# EAGLE design untitled (EAGLE 9.6.2)
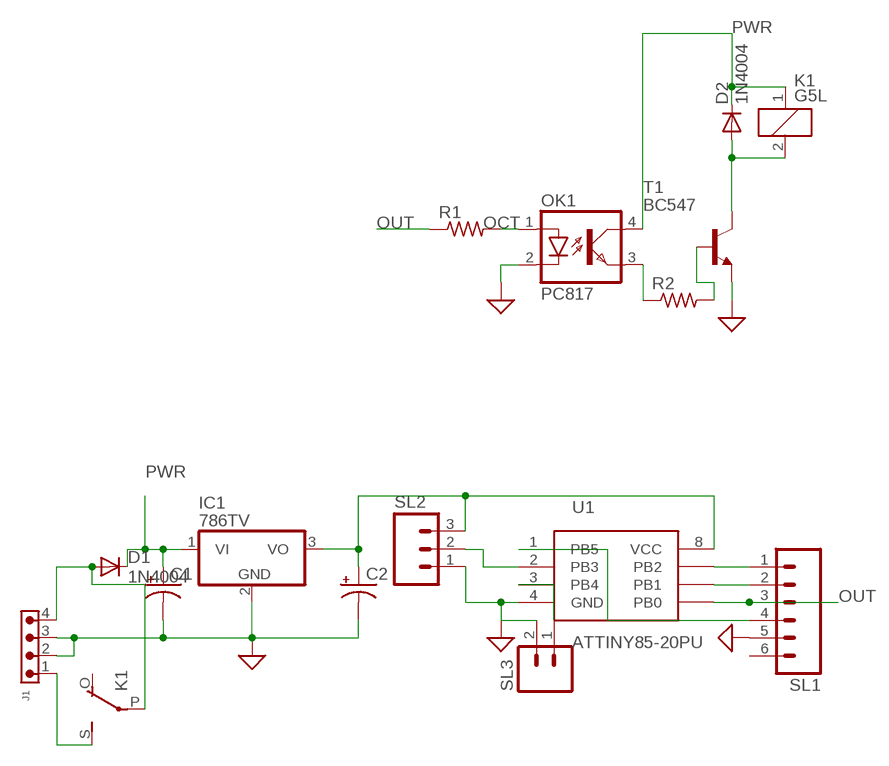
[diagram p0: schematic, sheet 1]

## Parts
C1  CAPACITOR-PE5-10.5  [E5-10,5]
C2  CAPACITOR-PE2.5-5  [E2,5-5]
D1  1N4004  [DO41-10]
D2  1N4004  [DO41-10]
IC1  786TV  [TO220V]
J1  691305530004  [691305530004]
K1  G5L  [G5LE]
OK1  PC817  [DIL04]
R1  R-US_0411/15  [0411/15]
R2  R-US_0207/10  [0207/10]
SL1  M06  [06P]
SL2  M03  [03P]
SL3  M02  [02P]
T1  BC547  [TO92]
U1  ATTINY85-20PU  [PDIP-8]

## Nets
GND: C1.- C2.- IC1.2(GND) J1.2 J1.3 OK1.2(C) SL1.5 SL2.1 SL3.2 T1.1(E) U1.4(GND) ; supply symbol labelled SUP
N$1: D1.A J1.4 K1.P(2:P)
N$2: SL1.1 U1.7(PB2)
N$3: C2.+ IC1.3(VO) SL2.3 U1.8(VCC)
N$4: OK1.3(EMIT) R2.1
N$5: D2.A K1.2 T1.3(C)
N$6: J1.1 K1.S(2:S)
N$7: R2.2 T1.2(B)
N$8: SL1.2 U1.6(PB1)
N$10: SL1.4 U1.1(PB5)
N$11: SL2.2 U1.2(PB3)
N$12: SL3.1 U1.3(PB4)
OCT: OK1.1(A) R1.2
OUT: R1.1 SL1.3 U1.5(PB0)
PWR: C1.+ D1.C D2.C IC1.1(VI) K1.1 OK1.4(COL)
Unconnected: K1.O(2:O) SL1.6

## Library data of the parts
C1 C2 = BeagleBone_Blue_R3:CAPACITOR-P: POLARIZED CAPACITOR, American symbol
D1 D2 = adafruit:1N4004: DIODE General purpose 1N400x type rectifier (With bigger pads) http://www.ladyada.net/library/pcb/eaglelibrary.html
IC1 = linear:78*: Positive VOLTAGE REGULATOR Source: http://cache.national.com/ds/LM/LM78L05.pdf http://www.fairchildsemi.com/ds/LM/LM7805.pdf
J1 = Wurth_Connectors_WR-TBL Pluggable Connector:691305530004: WR-TBL Serie 3055 - 5,08 mm - PCB Header Vertical Entry with Plastic Latches KIND PROPERTIES Pitch 5.08 mm MATERIAL PROPERTIES Insulator Material PA66 Insulator Flammability Rating UL94 V-0 Insulator Color Green Terminal Material Copper Alloy Terminal Plating Tin-plated surface GENERAL INFORMATION Operating Temperature -40 up to +105 °C ELECTRICAL PROPERTIES IR UL 16 A Working Voltage [UL] 300 V (AC) Withstanding Voltage [UL] 2500 V (AC) Contact Resistance [UL] 20 mΩ CERTIFICATION UL Approval E315414 <https://www.we-online.com/catalog/media/o135349v209%20Family_WR-TBL3_6913055300xx.jpg> Details see: https://www.we-online.com/catalog/en/TBL_5_08_3055_6913055300XX/ Updated by Ella Wu 2019-12-30 2019(C) Wurth Elektronik; DATASHEET-URL: https://www.we-online.com/catalog/datasheet/691305530004.pdf; IR-UL: 16A; MOUNT: THT; PART-NUMBER: 691305530004; PINS: 4; PITCH: 5.08mm; TYPE: Vertical; WORKING-VOLTAGE-UL: 300V (AC)
K1 = relay:G5L: RELAY 1 x switch, 10 A/120 V AC, 8 A/30 V ADC, Omron; OC_FARNELL: unknown; OC_NEWARK: unknown
OK1 = optocoupler:PC817: SHARP OPTO COUPLER; MPN: PC817X4J000F; OC_FARNELL: 9707727; OC_NEWARK: 97K7059
R1 = BeagleBone_Black_Wireless:R-US_: RESISTOR, American symbol
R2 = adafruit:R-US_: RESISTOR, American symbol
SL1 = con-amp-quick:M06: AMP QUICK CONNECTOR; OC_FARNELL: unknown; OC_NEWARK: unknown
SL2 = con-amp-quick:M03: AMP QUICK CONNECTOR; OC_FARNELL: unknown; OC_NEWARK: unknown
SL3 = con-amp-quick:M02: AMP QUICK CONNECTOR; OC_FARNELL: unknown; OC_NEWARK: unknown
T1 = transistor:BC547: NPN TRANSISTOR
U1 = Microcontroller:ATTINY85-20PU: IC MCU 8BIT 8KB FLASH 8DIP Manufacturer's datasheet <http://ww1.microchip.com/downloads/en/DeviceDoc/Atmel-2586-AVR-8-bit-Microcontroller-ATtiny25-ATtiny45-ATtiny85_Datasheet-Summary.pdf>; CREATED_BY: PCBLayout.com; DIGI_KEY_PART_NUMBER: ATTINY85-20PU-ND; MANUFACTURER: Microchip Technology; MPN: ATTINY85-20PU; PACKAGE: 8-PDIP

## Board
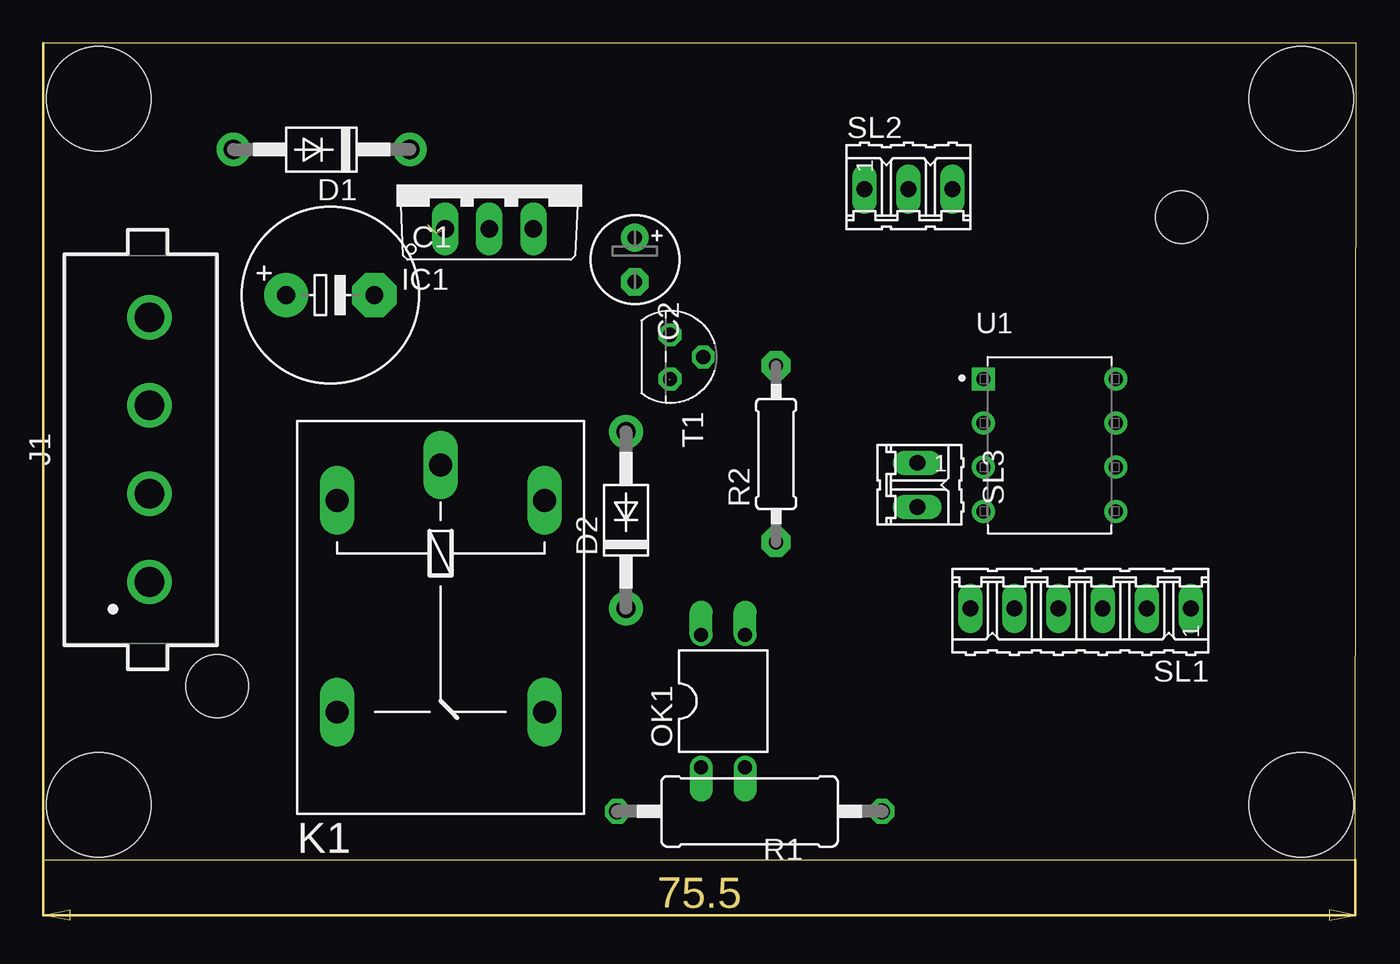
[diagram p1: board, top side]
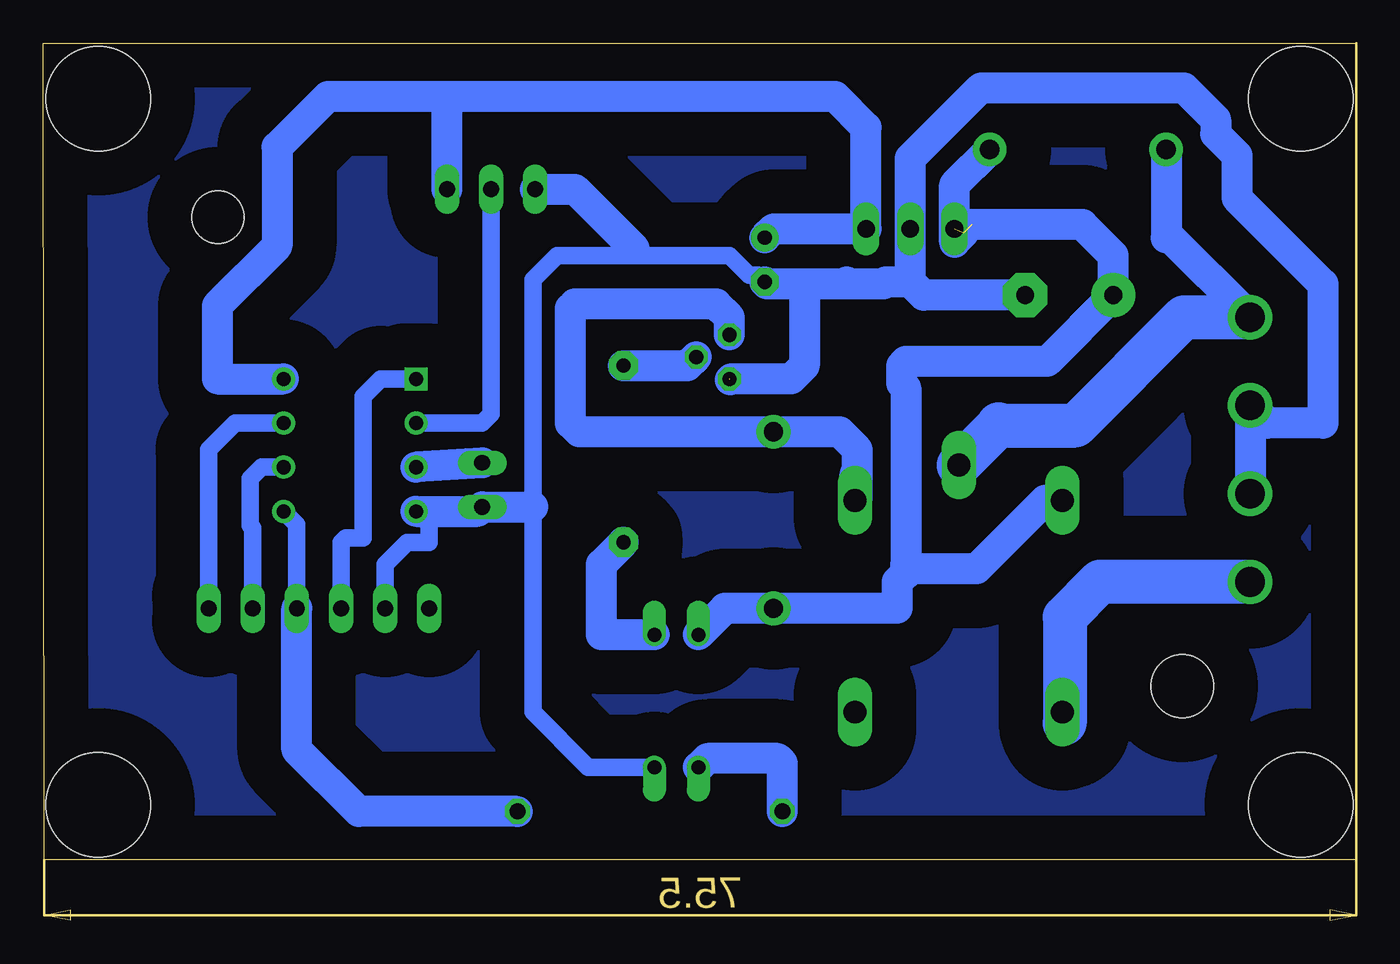
[diagram p2: board, bottom side, seen from below]

Size 75.55 x 47 mm. Coordinates in mm from the lower left corner, seen from the top.
Outline: 0,0 75.5,0 75.55,47 0,47 0,0
Copper layers (1*16): Top 0.035mm / dielectric 1.5mm / Bottom 0.035mm
Design rules "default *": minimum track width 6mil, minimum drill 0.35mm, track to track 30mil, track to pad 30mil, pad to pad 30mil, via to via 30mil, smd to smd 6mil, copper to edge 40mil, drill to drill 6mil, minimum pad ring 10mil, minimum via ring 8mil, stop-mask expansion 4mil, vias tented up to drill 0mil, thermal gap 10mil
Holes 6 mm at 3.17,43.81 3.17,3.17 72.39,3.17 72.39,43.81
Holes 3.6 mm at 10,10
Holes 3 mm at 65.5,37

### Footprints (pad centres in the part's own frame; a part is rotated, then mirrored left to right if it is on the bottom)
E5-10,5 = drill 1.016 pad 2.54: + -2.54,0 | drill 1.016 pad 2.54 octagon: - 2.54,0
E2,5-5 = drill 0.813 pad 1.6: + -1.27,0 | drill 0.813 pad 1.6 octagon: - 1.27,0
DO41-10 = drill 1.118 pad 1.93: A 5.08,0; C -5.08,0
TO220V = drill 1.016 long: 1 -2.54,-2.54; 2 0,-2.54; 3 2.54,-2.54
691305530004 = drill 1.7: 1 -7.62,0; 2 -2.54,0; 3 2.54,0; 4 7.62,0
G5LE = drill 1.321 long: 1 -7.493,-5.969; 2 -7.493,5.969; O 4.699,5.969; P -9.525,0; S 4.699,-5.969
DIL04 = drill 0.813 offset: 1 -1.27,-3.81; 2 1.27,-3.81; 3 1.27,3.81; 4 -1.27,3.81
0411/15 = drill 0.914 octagon: 1 -7.62,0; 2 7.62,0
0207/10 = drill 0.813 pad 1.676 octagon: 1 -5.08,0; 2 5.08,0
06P = drill 0.914 long: 1 -6.35,0; 2 -3.81,0; 3 -1.27,0; 4 1.27,0; 5 3.81,0; 6 6.35,0
03P = drill 0.914 long: 1 -2.54,0; 2 0,0; 3 2.54,0
02P = drill 0.914 long: 1 -1.27,0; 2 1.27,0
TO92 = drill 0.813 octagon: 1 1.27,0; 2 0,1.905; 3 -1.27,0
PDIP-8 = drill 0.813 pad 1.219 square: 1 -3.81,3.81 | drill 0.813 pad 1.219: 2 -3.81,1.27; 3 -3.81,-1.27; 4 -3.81,-3.81; 5 3.81,-3.81; 6 3.81,-1.27; 7 3.81,1.27; 8 3.81,3.81

### Placement (x,y rotation side)
C1  16.51,32.51 0 top
C2  34.04,34.54 270 top
D1  16,40.89 180 top
D2  33.53,19.56 90 top
IC1  25.65,38.86 0 top
J1  6.1,23.62 90 top
K1  22.86,13.21 270 top
OK1  39.12,9.14 0 top
R1  40.64,2.79 180 top
R2  42.16,23.37 90 top
SL1  59.69,14.48 180 top
SL2  49.78,38.61 0 top
SL3  50.29,21.59 270 top
T1  36.07,28.96 270 top
U1  57.91,23.88 0 top

### Tracks (layer width: path | path; a pad name or v marks a point on that pad's centre or on a via)
GND  (1 unrouted)
  Bottom 1.016: C2.- 34.42,33.66 34.93,33.66 36.07,34.8 41.15,34.8 | OK1.2 44.2,5.33 47.37,8.51 47.37,20.32 47.37,33.4 45.97,34.8 41.15,34.8 | SL1.5 55.88,17.02 54.61,18.29 53.34,18.29 53.34,19.3 U1.4 | 41.53,35.18 41.15,34.8
  Bottom 1.778: J1.3 6.35,26.42 | J1.3 J1.2 | J1.3 5.08,25.15 1.91,25.15 1.91,33.15 6.86,38.1 6.86,40.56 8.08,41.78 8.08,42.62 9.91,44.45 21.59,44.45 25.65,40.39 IC1.2 25.65,33.27 | C1.- 24.89,32.51 25.65,33.27 | 25.65,33.27 27.07,33.27 27.2,33.15 29.19,33.15 | 29.19,33.15 29.32,33.27 | 29.19,33.15 31.5,33.15 | 31.5,33.15 33.91,33.15 C2.- | 31.5,33.15 31.75,32.89 31.75,28.45 32.51,27.69 35.97,27.69 36.02,27.64 | U1.4 50.55,20.07 SL3.2 47.37,20.32 | SL2.1 44.96,38.61 41.53,35.18
N$1
  Bottom 1.778: J1.4 10.79,35.94 10.92,35.81 D1.A | 20.57,25.07 16.08,25.07
  Bottom 2.54: K1.P 20.57,25.02 | 20.57,25.07 20.57,25.02 | 20.57,25.02 16.13,25.02 16.08,25.07 9.91,31.24 J1.4
N$2
  Bottom 1.016: U1.7 64.52,25.15 66.04,23.62 SL1.1 66.04,13.72
N$3
  Bottom 1.016: 52.32,43.43 52.32,43.94
  Bottom 1.778: C2.+ 33.53,36.32 IC1.3 28.19,42.16 29.97,43.94 52.32,43.94 59.18,43.94 62.09,41.03 62.09,35.34 65.53,31.9 65.53,27.69 U1.8 | SL2.3 52.32,43.43
N$4
  Bottom 1.778: R2.1 43.43,17.02 43.43,12.95 OK1.3
N$5
  Bottom 1.778: 28.83,22.23 K1.2 28.7,20.83 28.7,23.62 29.72,24.64 D2.A 44.7,24.64 45.21,25.15 45.21,31.75 44.96,32 36.83,32 36.07,31.24 T1.3
N$6
  Bottom 1.778: K1.S 16.76,8.64 16.76,13.97
  Bottom 2.54: J1.1 14.73,16 16.76,13.97 16.76,7.87
N$7
  Bottom 1.778: R2.2 38.48,28.45 T1.2
N$8
  Bottom 1.016: SL1.2 63.5,19.11 63.65,19.27 63.65,21.95 62.99,22.61 U1.6
N$9
  pour Bottom (isolate 2.54): 0,47.24 75.44,47.24 75.44,0 0,0
N$10
  Bottom 1.016: SL1.4 58.42,18.29 58.17,18.54 57.15,18.54 57.15,26.67 56.13,27.69 U1.1
N$11
  Bottom 1.016: U1.2 50.29,25.15 49.78,25.65 SL2.2
N$12
  Bottom 1.778: SL3.1 U1.3
OCT
  Bottom 1.778: R1.2 33.02,5.59 33.27,5.84 37.34,5.84 OK1.1
OUT
  Bottom 1.016: SL1.3 60.96,19.3 U1.5
  Bottom 1.778: R1.1 57.4,2.79 60.96,6.35 SL1.3
PWR  (2 unrouted)
  Bottom 1.778: D1.C 23.11,38.86 23.11,35.56 22.61,36.07 | K1.1 17.91,20.7 21.84,16.76 25.65,16.76 | 25.65,16.76 25.91,17.02 25.91,27.18 26.16,27.43 26.16,28.45 25.91,28.7 17.78,28.7 C1.+ 13.97,34.8 15.75,36.58 22.1,36.58 | 25.65,16.76 26.42,16 26.42,14.48 D2.C 36.32,14.48 OK1.4